# Altium schematic sheet target mcu.SchDoc
size A4
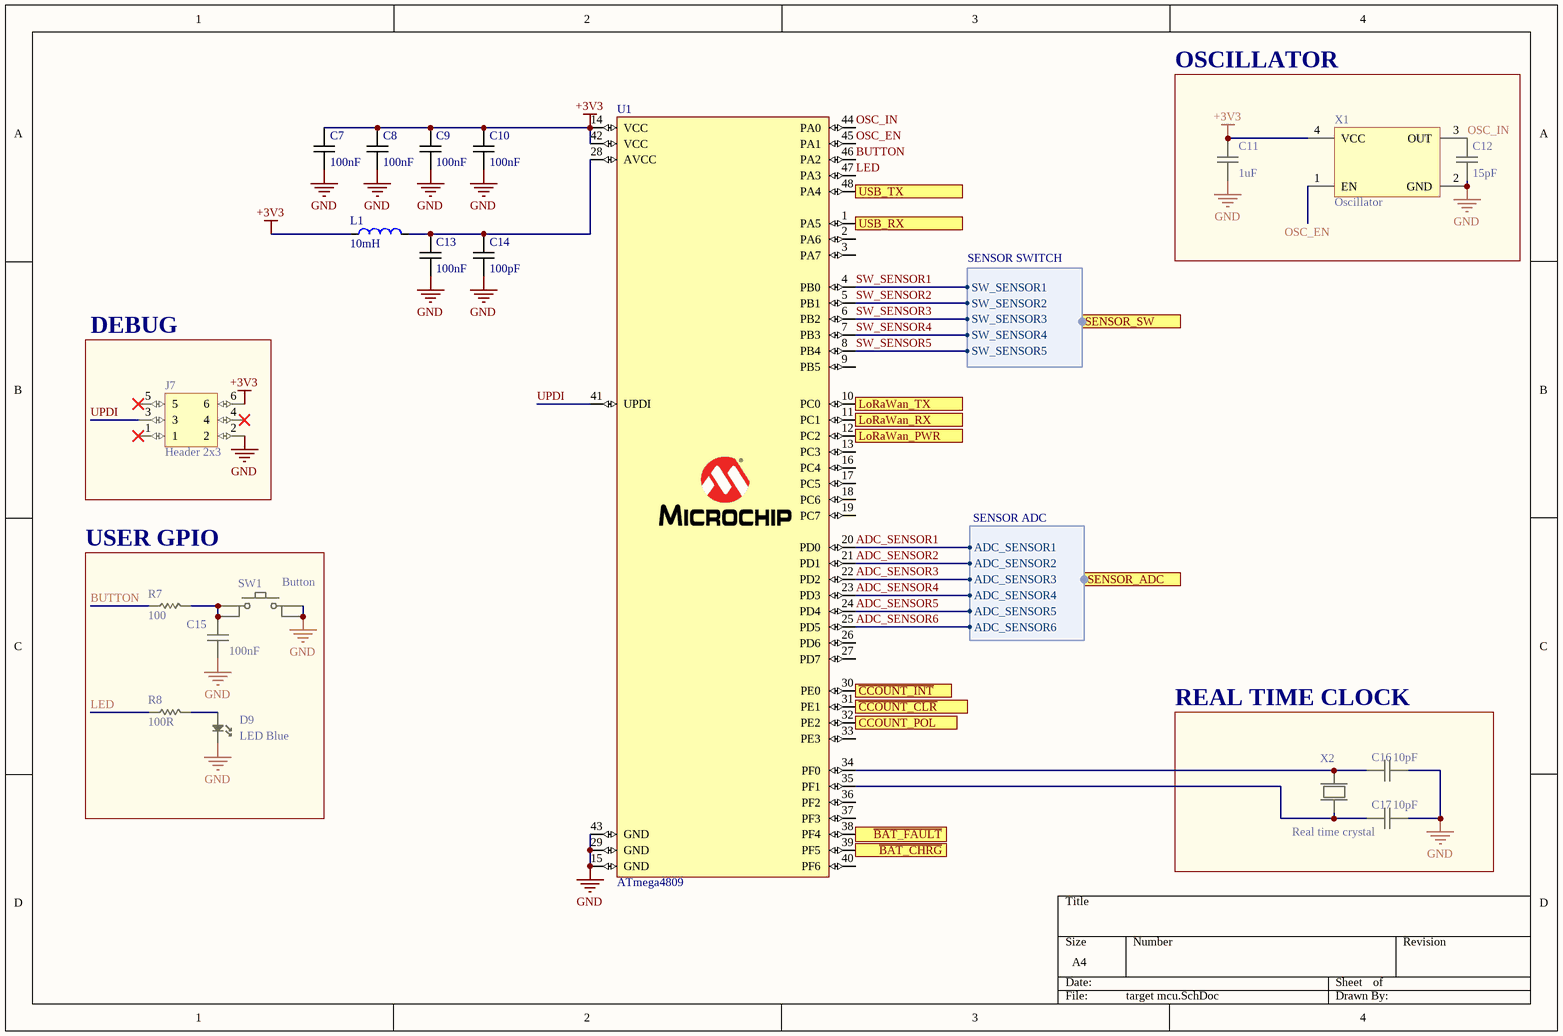
[diagram p0: target mcu.SchDoc]

## Parts
C7  value 100nF  [C0402]  (hidden comment: Capacitor 0402)
C8  value 100nF  [C0402]  (hidden comment: Capacitor 0402)
C9  value 100nF  [C0402]  (hidden comment: Capacitor 0402)
C10  value 100nF  [C0402]  (hidden comment: Capacitor 0402)
C11  value 1uF  [C0603]  (hidden comment: Capacitor 0603)
C12  value 15pF  [C0603]  (hidden comment: Capacitor 0603)
C13  value 100nF  [C0402]  (hidden comment: Capacitor 0402)
C14  value 100pF  [C0402]  (hidden comment: Capacitor 0402)
C15  value 100nF  [C0603]  (hidden comment: Capacitor 0603)
C16  value 10pF  [C0603]  (hidden comment: Capacitor 0603)
C17  value 10pF  [C0603]  (hidden comment: Capacitor 0603)
D9  LED Blue  [L0603 BLUE]
J7  Header 2x3  [Header 2x3 Male]
L1  value 10mH  [Inductor 0603]  (hidden comment: Inductor 0603)
R7  value 100  [R0603]  (hidden comment: Resistor 0603)
R8  value 100R  [R0603]  (hidden comment: Resistor 0603)
SW1  Button  [Button SMD]
U1  ATmega4809  [ATmega4809]
X1  Oscillator  [Crystal SMD 3.2x2.5]
X2  Real time crystal  [Realtime crystal SMD 4.2x1.45mm]

## Blocks framed on the sheet
OSCILLATOR: C11 C12 X1
DEBUG: J7
USER GPIO: C15 D9 R7 R8 SW1
REAL TIME CLOCK: C16 C17 X2

## Ports
CCOUNT_POL (in), LoRaWan_PWR (out), LoRaWan_RX (in), LoRaWan_TX (out), SENSOR_ADC (harness SENSOR ADC), SENSOR_SW (harness SENSOR SWITCH), USB_RX (in), USB_TX (out), ~{BAT_CHRG} (out), ~{BAT_FAULT} (out), ~{CCOUNT_CLR} (out), ~{CCOUNT_INT} (in)

## Harnesses
SENSOR SWITCH: SW_SENSOR1, SW_SENSOR2, SW_SENSOR3, SW_SENSOR4, SW_SENSOR5
SENSOR ADC: ADC_SENSOR1, ADC_SENSOR2, ADC_SENSOR3, ADC_SENSOR4, ADC_SENSOR5, ADC_SENSOR6

## Nets
+3V3: C7.2 C8.2 C9.2 C10.2 C11.2 J7.6 L1.1 U1.14(VCC) U1.42(VCC) X1.4(VCC)
GND: C7.1 C8.1 C9.1 C10.1 C11.1 C12.1 C13.1 C14.1 C15.1 C16.2 C17.2 D9.2 J7.2 SW1.3 SW1.4 U1.15(GND) U1.29(GND) U1.43(GND) X1.2(GND)
ADC_SENSOR1: U1.20(PD0) ; port SENSOR_ADC.ADC_SENSOR1
ADC_SENSOR2: U1.21(PD1) ; port SENSOR_ADC.ADC_SENSOR2
ADC_SENSOR3: U1.22(PD2) ; port SENSOR_ADC.ADC_SENSOR3
ADC_SENSOR4: U1.23(PD3) ; port SENSOR_ADC.ADC_SENSOR4
ADC_SENSOR5: U1.24(PD4) ; port SENSOR_ADC.ADC_SENSOR5
ADC_SENSOR6: U1.25(PD5) ; port SENSOR_ADC.ADC_SENSOR6
~{BAT_CHRG}: U1.39(PF5) ; port ~{BAT_CHRG}
~{BAT_FAULT}: U1.38(PF4) ; port ~{BAT_FAULT}
BUTTON: R7.1 U1.46(PA2)
~{CCOUNT_CLR}: U1.31(PE1) ; port ~{CCOUNT_CLR}
~{CCOUNT_INT}: U1.30(PE0) ; port ~{CCOUNT_INT}
CCOUNT_POL: U1.32(PE2) ; port CCOUNT_POL
LED: R8.1 U1.47(PA3)
LoRaWan_PWR: U1.12(PC2) ; port LoRaWan_PWR
LoRaWan_RX: U1.11(PC1) ; port LoRaWan_RX
LoRaWan_TX: U1.10(PC0) ; port LoRaWan_TX
OSC_EN: U1.45(PA1) X1.1(EN)
OSC_IN: C12.2 U1.44(PA0) X1.3(OUT)
SW_SENSOR1: U1.4(PB0) ; port SENSOR_SW.SW_SENSOR1
SW_SENSOR2: U1.5(PB1) ; port SENSOR_SW.SW_SENSOR2
SW_SENSOR3: U1.6(PB2) ; port SENSOR_SW.SW_SENSOR3
SW_SENSOR4: U1.7(PB3) ; port SENSOR_SW.SW_SENSOR4
SW_SENSOR5: U1.8(PB4) ; port SENSOR_SW.SW_SENSOR5
UPDI: J7.3 U1.41(UPDI)
USB_RX: U1.1(PA5) ; port USB_RX
USB_TX: U1.48(PA4) ; port USB_TX
NetC13_2: C13.2 C14.2 L1.2 U1.28(AVCC)
NetC15_2: C15.2 R7.2 SW1.1 SW1.2
NetC16_1: C16.1 U1.34(PF0) X2.2
NetC17_1: C17.1 U1.35(PF1) X2.1
NetD9_1: D9.1 R8.2

Not connected (* = marked no-connect by the designer): J7 1* 4* 5*; U1 2(PA6) 3(PA7) 9(PB5) 13(PC3) 16(PC4) 17(PC5) 18(PC6) 19(PC7) 26(PD6) 27(PD7) 33(PE3) 36(PF2) 37(PF3) 40(PF6)

## Library data of the parts
D9 = LED 0603 Blue
J7 = Header  2x3 Male
SW1 = Button SMD
X1 = Oscillator 3.2x2.5mm
X2 = Realtime crystal SMD 5.2x1.45mm